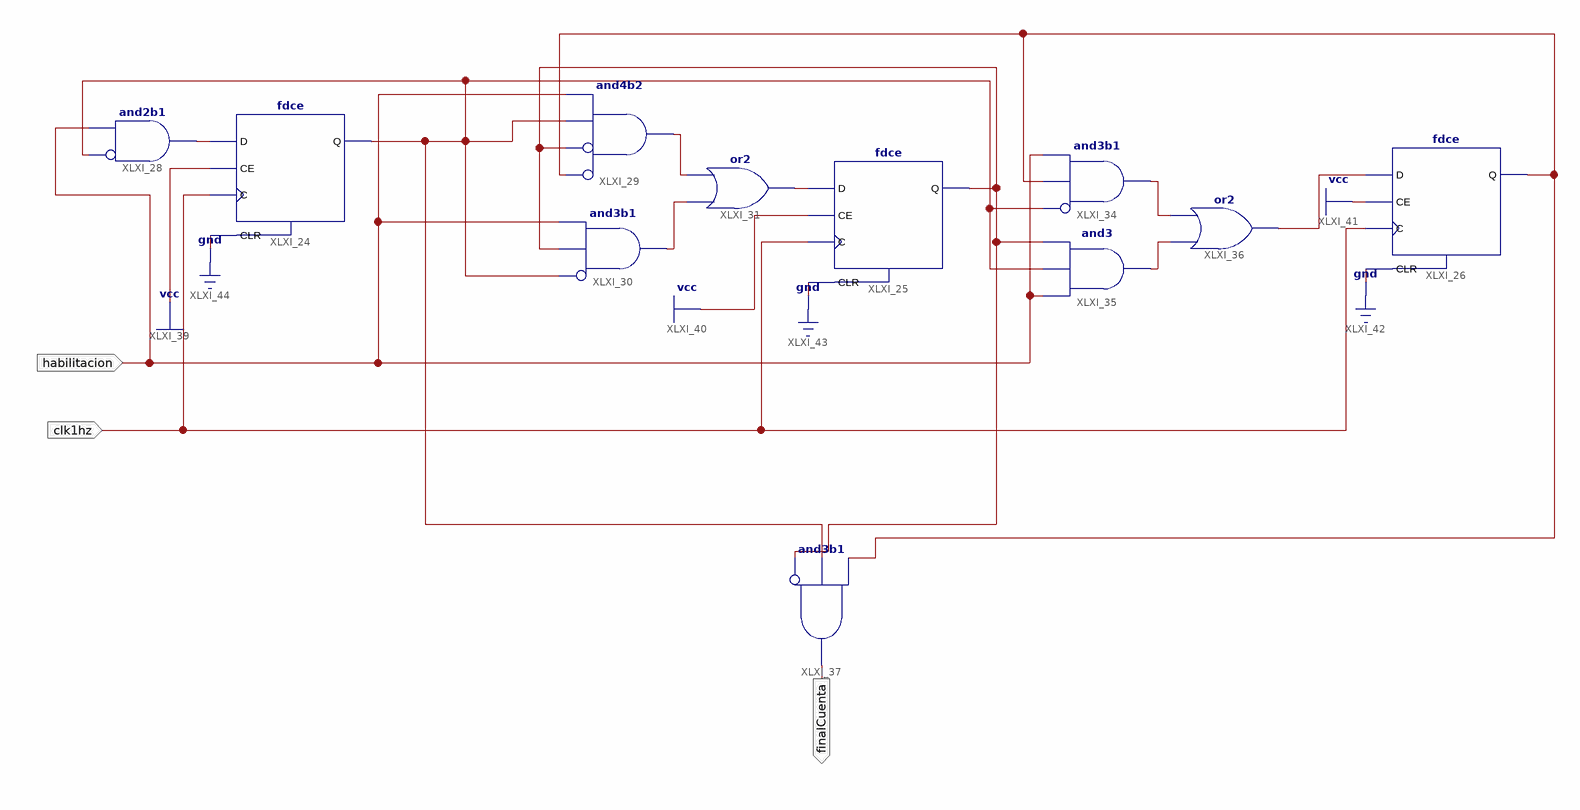
[diagram p0: schematic sheet 1]
// Xilinx ISE schematic contador5sin.sch (spartan3e) as structural Verilog: 11 symbols, 3 ports
module contador5sin (
  input  clk1hz,
  input  habilitacion,
  output finalCuenta
);

  wire XLXN_32, XLXN_34, XLXN_35, XLXN_36, XLXN_41, XLXN_49, XLXN_50, XLXN_51, XLXN_55, XLXN_60;

  fdce XLXI_25 (.C(clk1hz), .CE(1'b1), .CLR(1'b0), .D(XLXN_36), .Q(XLXN_41));
  fdce XLXI_26 (.C(clk1hz), .CE(1'b1), .CLR(1'b0), .D(XLXN_51), .Q(XLXN_55));
  and XLXI_29 (XLXN_34, ~XLXN_55, ~XLXN_41, XLXN_60, habilitacion);  // and4b2
  and XLXI_30 (XLXN_35, ~XLXN_60, XLXN_41, habilitacion);  // and3b1
  or XLXI_31 (XLXN_36, XLXN_35, XLXN_34);
  fdce XLXI_24 (.C(clk1hz), .CE(1'b1), .CLR(1'b0), .D(XLXN_32), .Q(XLXN_60));
  and XLXI_28 (XLXN_32, ~XLXN_60, habilitacion);  // and2b1
  and XLXI_34 (XLXN_50, ~XLXN_60, XLXN_55, habilitacion);  // and3b1
  and XLXI_35 (XLXN_49, habilitacion, XLXN_60, XLXN_41);
  or XLXI_36 (XLXN_51, XLXN_49, XLXN_50);
  and XLXI_37 (finalCuenta, ~XLXN_41, XLXN_60, XLXN_55);  // and3b1
endmodule
